# Altium schematic sheet ltk-hall-main.SchDoc
size A3; Organization: Altium Limited; Address1: L3, 12a Rodborough Rd; Address2: Frenchs Forest; Address3: NSW; Address4: Australia 2086
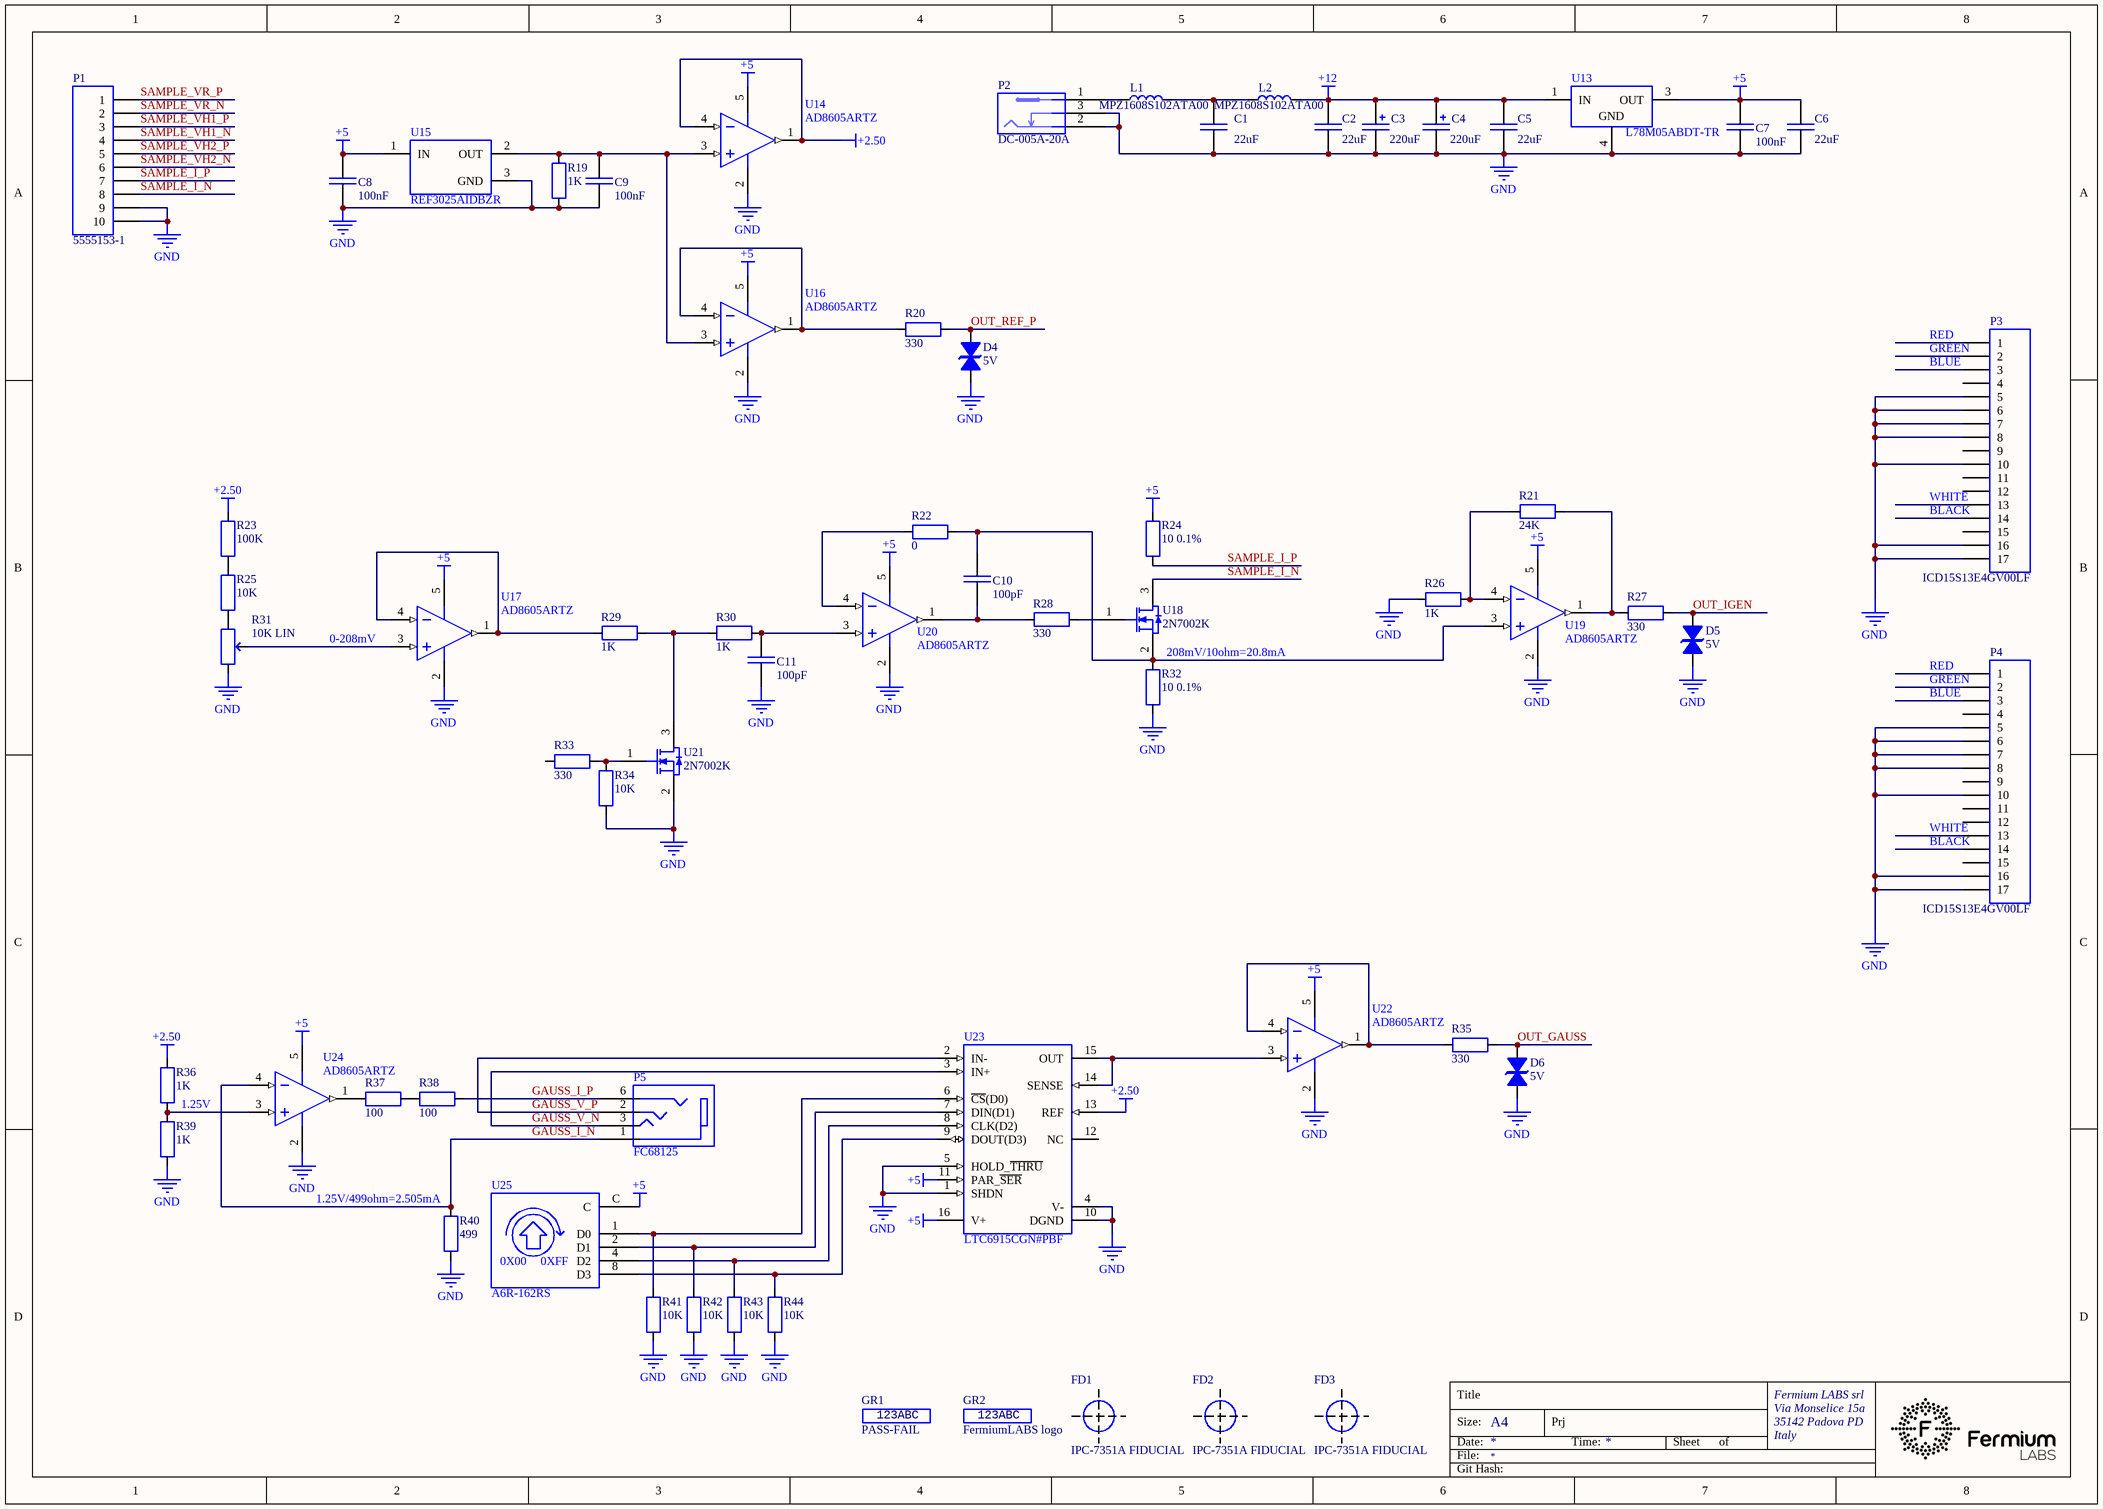
[diagram p0: ltk-hall-main.SchDoc]

## Parts
C1  22uF  [CAP 0805_2012]
C2  22uF  [CAP 0805_2012]
C3  220uF  [3924B366-8672-45E9-B0BE-62DACC24E783]
C4  220uF  [3924B366-8672-45E9-B0BE-62DACC24E783]
C5  22uF  [CAP 0805_2012]
C6  22uF  [CAP 0805_2012]
C7  100nF  [CAP 0603_1608]
C8  100nF  [CAP 0603_1608]
C9  100nF  [CAP 0603_1608]
C10  100pF  [CAP 0603_1608]
C11  100pF  [CAP 0603_1608]
D4  5V  [SOD523F]
D5  5V  [SOD523F]
D6  5V  [SOD523F]
FD1  IPC-7351A FIDUCIAL  [FIDUCIAL-IPC-7351A]  (no BOM)
FD2  IPC-7351A FIDUCIAL  [FIDUCIAL-IPC-7351A]  (no BOM)
FD3  IPC-7351A FIDUCIAL  [FIDUCIAL-IPC-7351A]  (no BOM)
GR1  PASS-FAIL  [0B1556B7-A534-4801-B57D-01EFA34B1205]  (no BOM)
GR2  FermiumLABS logo  [5394DE47-A0E8-4329-8464-7791B7C19310]  (no BOM)
L1  MPZ1608S102ATA00  [FER 0603_1608]
L2  MPZ1608S102ATA00  [FER 0603_1608]
P1  5555153-1  [03FA2727-72E9-446E-856D-3DD573B1EBDD]
P2  DC-005A-20A  [F0972D8A-C5C0-4A84-836D-A9666EE65C2D]
P3  ICD15S13E4GV00LF  [66D8AC91-DC10-42D3-BF25-693004815827]
P4  ICD15S13E4GV00LF  [66D8AC91-DC10-42D3-BF25-693004815827]
P5  FC68125  [977BFFC7-4CFC-4119-A8B4-AB88E5A1DB2B]
R19  1K  [RES 0603_1608]
R20  330
R21  24K
R22  0  [RES 0603_1608]
R23  100K
R24  10 0.1%  [RES 0603_1608]
R25  10K  [RES 0603_1608]
R26  1K  [RES 0603_1608]
R27  330
R28  330
R29  1K  [RES 0603_1608]
R30  1K  [RES 0603_1608]
R31  10K LIN  [2EF88547-EDEF-4A49-A522-C215618D4BC7]
R32  10 0.1%  [RES 0603_1608]
R33  330
R34  10K  [RES 0603_1608]
R35  330
R36  1K  [RES 0603_1608]
R37  100
R38  100
R39  1K  [RES 0603_1608]
R40  499
R41  10K  [RES 0603_1608]
R42  10K  [RES 0603_1608]
R43  10K  [RES 0603_1608]
R44  10K  [RES 0603_1608]
U13  L78M05ABDT-TR  [4BDA507D-BB70-4009-B963-85AD90086B51]
U14  AD8605ARTZ  [A3DDA0BC-073E-4B18-9613-F713A7EC1E27]
U15  REF3025AIDBZR  [TI SOT-23-3 DBZ]
U16  AD8605ARTZ  [A3DDA0BC-073E-4B18-9613-F713A7EC1E27]
U17  AD8605ARTZ  [A3DDA0BC-073E-4B18-9613-F713A7EC1E27]
U18  2N7002K  [ON SEMI SOT-23-3]
U19  AD8605ARTZ  [A3DDA0BC-073E-4B18-9613-F713A7EC1E27]
U20  AD8605ARTZ  [A3DDA0BC-073E-4B18-9613-F713A7EC1E27]
U21  2N7002K  [ON SEMI SOT-23-3]
U22  AD8605ARTZ  [A3DDA0BC-073E-4B18-9613-F713A7EC1E27]
U23  LTC6915CGN#PBF  [517EE8A2-9FD8-4174-996D-BDBF76CA3EEB]
U24  AD8605ARTZ  [A3DDA0BC-073E-4B18-9613-F713A7EC1E27]
U25  A6R-162RS  [2599C238-5645-4A8C-8BF9-C7515FACCFA0]

## Nets
+2.50: R23.2 R36.2 U14.1(OUT) U14.4(-IN) U23.13(REF)
+5: C6.1 C7.1 C8.1 R24.2 U13.3(OUT) U14.5(+V) U15.1(IN) U16.5(+V) U17.5(+V) U19.5(+V) U20.5(+V) U22.5(+V) U23.11(PAR_~{SER}) U23.16(V+) U24.5(+V) U25.C
+12: C2.1 C3.1 C4.1 C5.1 L2.2 U13.1(IN)
GND: C1.2 C2.2 C3.2 C4.2 C5.2 C6.2 C7.2 C8.2 C9.2 C11.2 D4.2 D5.2 D6.2 P1.9 P1.10 P2.2 P2.3 P3.5 P3.6 P3.7 P3.8 P3.10 P3.16 P3.17 P4.5 P4.6 P4.7 P4.8 P4.10 P4.16 P4.17 R19.1 R26.1 R31.3 R32.1 R34.1 R39.1 R40.1 R41.1 R42.1 R43.1 R44.1 U13.4(GND) U14.2(-V) U15.3(GND) U16.2(-V) U17.2(-V) U19.2(-V) U20.2(-V) U21.2(S) U22.2(-V) U23.1(SHDN) U23.4(V-) U23.5(HOLD_~{THRU}) U23.10(DGND) U24.2(-V)
GAUSS_I_N: P5.1 R40.2 U24.4(-IN)
GAUSS_I_P: P5.6 R38.2
GAUSS_V_N: P5.3 U23.3(IN+)
GAUSS_V_P: P5.2 U23.2(IN-)
OUT_GAUSS: D6.1 R35.2
OUT_IGEN: D5.1 R27.2
OUT_REF_P: D4.1 R20.2
SAMPLE_I_N: P1.8 U18.3(D)
SAMPLE_I_P: P1.7 R24.1
SAMPLE_VH1_N: P1.4
SAMPLE_VH1_P: P1.3
SAMPLE_VH2_N: P1.6
SAMPLE_VH2_P: P1.5
SAMPLE_VR_N: P1.2
SAMPLE_VR_P: P1.1
NetC1_1: C1.1 L1.2 L2.1
NetC9_1: C9.1 R19.2 U14.3(+IN) U15.2(OUT) U16.3(+IN)
NetC10_1: C10.1 R22.2 R32.2 U18.2(S) U19.3(+IN)
NetC10_2: C10.2 R28.1 U20.1(OUT)
NetC11_1: C11.1 R30.2 U20.3(+IN)
NetL1_1: L1.1 P2.1
NetR20_1: R20.1 U16.1(OUT) U16.4(-IN)
NetR21_1: R21.1 R26.2 U19.4(-IN)
NetR21_2: R21.2 R27.1 U19.1(OUT)
NetR22_1: R22.1 U20.4(-IN)
NetR23_1: R23.1 R25.2
NetR25_1: R25.1 R31.1
NetR28_2: R28.2 U18.1(G)
NetR29_1: R29.1 U17.1(OUT) U17.4(-IN)
NetR29_2: R29.2 R30.1 U21.3(D)
NetR31_2: R31.2 U17.3(+IN)
NetR33_2: R33.2 R34.2 U21.1(G)
NetR35_1: R35.1 U22.1(OUT) U22.4(-IN)
NetR36_1: R36.1 R39.2 U24.3(+IN)
NetR37_1: R37.1 U24.1(OUT)
NetR37_2: R37.2 R38.1
NetR41_2: R41.2 U23.6(~{CS}(D0)) U25.1(D0)
NetR42_2: R42.2 U23.7(DIN(D1)) U25.2(D1)
NetR43_2: R43.2 U23.8(CLK(D2)) U25.4(D2)
NetR44_2: R44.2 U23.9(DOUT(D3)) U25.8(D3)
NetU22_3: U22.3(+IN) U23.14(SENSE) U23.15(OUT)

Not connected (* = marked no-connect by the designer): P3 1 2 3 4 9 11 12 13 14 15; P4 1 2 3 4 9 11 12 13 14 15; R33 1; U23 12(NC)

## Notes on the sheet
- (near P3) GREEN
- (near P3) BLUE
- (near P3) RED
- (near P3) WHITE
- (near P3) BLACK
- (near U17) 0-208mV
- 208mV/10ohm=20.8mA
- (near P4) GREEN
- (near P4) BLUE
- (near P4) RED
- (near P4) WHITE
- (near P4) BLACK
- 1.25V
- (near R40) 1.25V/499ohm=2.505mA
- Title
- Fermium LABS srl
- Size:
- Date:
- File:
- A4
- Prj
- Time:
- Sheet
- of
- Via Monselice 15a
- 35142 Padova PD
- Italy
- Git Hash:
- (in symbol 50f8ea88-0034-49fe-a263-d8e97bc35e2f) 123ABC
- (in symbol bbf157ad-cd7a-4e82-97e3-d6a037590888) 0X00; 0XFF
- (in symbol d1abe19f-3fed-4f20-b2ed-afc0ffbc6628) 123ABC

## Library data of the parts
C1 C2 C5 C6 = 4e18e584-a077-4dfe-b9da-5e528e787323: CAP SMD MLCC 22uF 25V 0805 X5R; Manufacturer 1: Samsung Electro-Mechanics; Manufacturer Part Number 1: CL21A106KAYNNNE; id: 14817; Part Number: 4e18e584-a077-4dfe-b9da-5e528e787323; Manufacturer 2: Murata; Manufacturer Part Number 2: GRM21BR61E106KA73L; Value: 22uF
C3 C4 = 1a28df19-6d3e-4a71-836c-f22920f8e8ab: CAP  THT ELEC 220uF 25V 20%; Manufacturer 1: Rubycon; Manufacturer Part Number 1: 25PK220MEFC-6.3*11; id: 14782; Part Number: 1a28df19-6d3e-4a71-836c-f22920f8e8ab; ComponentLink1Description: Datasheet; ComponentLink1URL: http://localhost:8080/static/files/Rubycon-220uF-25V_C109337_12019-03-10_214953.757848.pdf?Rubycon-220uF-25V_C109337 (1).pdf; Value: 220uF
C7-C9 = 02841f84-ac15-41b5-9e17-915f8f067828: CAP SMD MLCC 100nF 25V 0603 X7R; Manufacturer 1: Samsung Electro-Mechanics; Manufacturer Part Number 1: CL10B104KA8NNNC; id: 14784; Part Number: 02841f84-ac15-41b5-9e17-915f8f067828; ComponentLink1Description: Datasheet; ComponentLink1URL: http://localhost:8080/static/files/Samsung-Electro-Mechanics-CL10B104KA8NNNC_C15902019-03-10_215548.826887.pdf?Samsung-Electro-Mechanics-CL10B104KA8NNNC_C1590.pdf; Value: 100nF
C10 C11 = ccf679fd-1b09-4431-be81-04c3ce295510: CAP SMD MLCC 100pF 100V 0603 C0G/NP0; Manufacturer 1: Yageo; Manufacturer Part Number 1: CC0603JRNPO0BN101; id: 14804; Part Number: ccf679fd-1b09-4431-be81-04c3ce295510; Value: 100pF
D4-D6 = daa58212-38e2-4326-a156-8e48058c46f1: DIODE SMD TVS 5V BIDIRECTIONAL SOD-523; Manufacturer 1: Born Semiconductor; Manufacturer Part Number 1: PESD5V0S1BBN; id: 14837; Part Number: daa58212-38e2-4326-a156-8e48058c46f1; ComponentLink1Description: Datasheet; ComponentLink1URL: http://localhost:8080/static/files/Nexperia-PESD5V0S1BB-115_C976402019-08-16_201905.624024.pdf?Nexperia-PESD5V0S1BB-115_C97640.pdf; ComponentLink2Description: Datasheet; ComponentLink2URL: http://localhost:8080/static/files/1901051701_Bourne-Semicon-Shenzhen-PESD5V0S1BBN_C3142642019-08-16_201911.992552.pdf?1901051701_Bourne-Semicon-Shenzhen-PESD5V0S1BBN_C314264.pdf; Manufacturer 2: Nexperia; Manufacturer Part Number 2: PESD5V0S1BB,115; Value: 5V
FD1-FD3 = 19da4612-eb95-43bb-9984-553a52b2a224: GRAPHICS FIDUCIAL IPC-7351A; id: 14800; Part Number: 19da4612-eb95-43bb-9984-553a52b2a224
GR1 = d1abe19f-3fed-4f20-b2ed-afc0ffbc6628: GRAPHICS PASS-FAIL MARK; id: 14801; Part Number: d1abe19f-3fed-4f20-b2ed-afc0ffbc6628
GR2 = 50f8ea88-0034-49fe-a263-d8e97bc35e2f: GRAPHICS LOGO FERMIUM LABS SRL; id: 14799; Part Number: 50f8ea88-0034-49fe-a263-d8e97bc35e2f
L1 L2 = a4b2e015-bf25-47b8-954c-a5b040744a3a: FER SMD CHIP 0603 800mA 1K@100MHz 300mOhm; Manufacturer 1: TDK; id: 14850; Part Number: a4b2e015-bf25-47b8-954c-a5b040744a3a; ComponentLink1Description: Datasheet; ComponentLink1URL: http://localhost:8080/static/files/TDK-MPZ1608S102ATA00_C768142019-08-18_021255.210641.pdf?TDK-MPZ1608S102ATA00_C76814.pdf; Manufacturer Part Number 1: MPZ1608S102ATA00
P1 = f401b84a-9695-45b1-951e-00bef0039069: CONN RJ45 SHIELDED; Manufacturer 1: TE Connectivity; id: 14843; Part Number: f401b84a-9695-45b1-951e-00bef0039069; ComponentLink1Description: Product Page; ComponentLink1URL: https://www.te.com/usa-en/product-5555153-1.html?te_campaign=oct_glo_manufacturer&elqCampaignId=26136&te_bu=Cor&te_type=other; ComponentLink2Description: Datasheet; ComponentLink2URL: http://localhost:8080/static/files/TE-Connectivity-5555153-1_C1250722019-08-17_152708.984028.pdf?TE-Connectivity-5555153-1_C125072.pdf; ComponentLink3Description: 3D Model; ComponentLink3URL: http://localhost:8080/static/files/ENG_CVM_CVM_5555153-1_C.3d_stp2019-08-17_152716.824354.zip?ENG_CVM_CVM_5555153-1_C.3d_stp.zip; Manufacturer Part Number 1: 5555153-1
P2 = b53db51a-1725-412b-9039-fa7a45c7c438: CONN THT DC JACK 0.5A 30VDC 5Kcycles; Manufacturer 1: HRO Electronics; id: 14780; Part Number: b53db51a-1725-412b-9039-fa7a45c7c438; ComponentLink1Description: Datasheet; ComponentLink1URL: http://localhost:8080/static/files/Korean-Hroparts-Elec-DC-005A-20A_C191049_22019-03-10_214231.486078.pdf?Korean-Hroparts-Elec-DC-005A-20A_C191049 (2).pdf; Manufacturer Part Number 1: DC-005A-20A
P3 P4 = af155709-b835-40ac-b9b5-4a44b0fd2777: CONN D-SUB HD 15POLES BLACK THT; Manufacturer 1: FCI; id: 14838; Part Number: af155709-b835-40ac-b9b5-4a44b0fd2777; ComponentLink1Description: Mechanical Drawing; ComponentLink1URL: http://localhost:8080/static/files/c-cd-00112019-08-16_203054.958624.pdf?c-cd-0011.pdf; ComponentLink2Description: Datasheet; ComponentLink2URL: http://localhost:8080/static/files/io_dsub_highdensity2019-08-16_203112.582695.pdf?io_dsub_highdensity.pdf; Manufacturer Part Number 1: ICD15S13E4GV00LF
P5 = 3e3c57e9-f1b8-4c12-8bb1-97da9eb9c220: CONN JACK 3.5MM 4POLE THT; Manufacturer 1: Cliff; id: 14844; Part Number: 3e3c57e9-f1b8-4c12-8bb1-97da9eb9c220; ComponentLink1Description: Datasheet; ComponentLink1URL: http://localhost:8080/static/files/Cliff-FC68125-datasheet2019-08-17_161810.238588.pdf?Cliff-FC68125-datasheet.pdf; Manufacturer Part Number 1: FC68125
R19 R26 R29 R30 R36 R39 = a678220f-9e9d-4863-a833-9993504f723c: RES SMD 1K OHM 1% 1/10W 0603; Manufacturer 1: Yageo; Manufacturer Part Number 1: RC0603FR-071KL; id: 14794; Part Number: a678220f-9e9d-4863-a833-9993504f723c; Value: 1K
R20 R27 R28 R33 R35 = e8555d7b-eeda-4727-b2e1-550cdc03d819: RES SMD 330 OHM 1% 1/10W 0603; Manufacturer 1: Yageo; Manufacturer Part Number 1: RC0603FR-07330RL; id: 12350; Part Number: e8555d7b-eeda-4727-b2e1-550cdc03d819; Value: 330
R21 = 89bb9559-07ab-4a9e-ba67-95cb66f30425: RES SMD 24K OHM 1% 1/10W 0603; Manufacturer 1: Yageo; Manufacturer Part Number 1: RC0603FR-0724KL; id: 12540; Part Number: 89bb9559-07ab-4a9e-ba67-95cb66f30425; Value: 24K
R22 = 6ae227f9-847f-4766-8522-e11a83531204: RES SMD 0 OHM 5% 1/10W 0603; Manufacturer 1: Yageo; Manufacturer Part Number 1: RC0603JR-070RL; id: 11973; Part Number: 6ae227f9-847f-4766-8522-e11a83531204; Value: 0
R23 = a6f23dcb-1502-42e9-827e-4bdfa60be22f: RES SMD 100K OHM 1% 1/16W 0402; Manufacturer 1: Yageo; Manufacturer Part Number 1: RC0402FR-07100KL; id: 11589; Part Number: a6f23dcb-1502-42e9-827e-4bdfa60be22f; Value: 100K
R24 R32 = f0166db1-b7e4-4c18-9511-2907615c1c51: RES SMD 10 OHM 0.1% 1/16W 25ppm  0603; Manufacturer 1: Uniroyal; Manufacturer Part Number 1: TC0325B100JT5E; id: 14842; Part Number: f0166db1-b7e4-4c18-9511-2907615c1c51; Manufacturer 2: Viking Tech; Manufacturer Part Number 2: AR03BTCX0100; Value: 10 0.1%
R25 R34 R41-R44 = 93242766-ba1d-462d-b58f-ce1dfc4129c8: RES SMD 10K OHM 1% 1/10W 0603; Manufacturer 1: Yageo; Manufacturer Part Number 1: RC0603FR-0710KL; id: 12101; Part Number: 93242766-ba1d-462d-b58f-ce1dfc4129c8; Value: 10K
R31 = 3df905ea-1e80-4add-859d-a36edd7f106c: POT 10K 20% SHAFT 6mmx7.4mm LIN; Manufacturer 1: ALPS; Manufacturer Part Number 1: RK09K1130A6S; id: 14828; Part Number: 3df905ea-1e80-4add-859d-a36edd7f106c; ComponentLink1Description: 3D Model; ComponentLink1URL: http://localhost:8080/static/files/RK09K1130A6S2019-08-17_031625.830758.zip?RK09K1130A6S.zip; ComponentLink2Description: Datasheet; ComponentLink2URL: http://localhost:8080/static/files/ALPS-Electric-RK09K1130A6S_C2097702019-08-17_031651.036431.pdf?ALPS-Electric-RK09K1130A6S_C209770.pdf; Value: 10K LIN
R37 R38 = 0a6c4b74-f837-4563-b154-6e196d753525: RES SMD 100 OHM 1% 1/10W 0603; Manufacturer 1: Yageo; Manufacturer Part Number 1: RC0603FR-07100RL; id: 12301; Part Number: 0a6c4b74-f837-4563-b154-6e196d753525; Value: 100
R40 = 3a10051a-dd65-4121-b0b9-1b40351a1843: RES SMD 499 OHM 1% 1/10W 0603; Manufacturer 1: Yageo; Manufacturer Part Number 1: RC0603FR-07499RL; id: 12368; Part Number: 3a10051a-dd65-4121-b0b9-1b40351a1843; Value: 499
U13 = 446536aa-1bdd-4764-8cae-49f4e0c126ff: IC SMD LINEAR VOLTAGE REGULATOR 5V 500mA DPAK/TO-252; Manufacturer 1: ST Microelectronics; id: 14848; Part Number: 446536aa-1bdd-4764-8cae-49f4e0c126ff; ComponentLink1Description: Datasheet; ComponentLink1URL: http://localhost:8080/static/files/STMicroelectronics-L78M05ABDT-TR_C580692019-08-17_184424.026041.pdf?STMicroelectronics-L78M05ABDT-TR_C58069.pdf; Manufacturer Part Number 1: L78M05ABDT-TR
U14 U16 U17 U19 U20 U22 U24 = 5610e9ea-bca8-49b2-8e5f-11409231f6a4: IC OPAMP 65uV 1pA RRIO 5V 80mA SOT-23-5; Manufacturer 1: Analog Devices; id: 14830; Part Number: 5610e9ea-bca8-49b2-8e5f-11409231f6a4; ComponentLink1Description: Datasheet; ComponentLink1URL: http://localhost:8080/static/files/Analog_Devices-AD8605ARTZ-REEL7-datasheet2019-08-16_175825.352099.pdf?Analog_Devices-AD8605ARTZ-REEL7-datasheet.pdf; Manufacturer Part Number 1: AD8605ARTZ
U15 = 0de0df07-6dfd-42d8-9fe7-171c27772811: IC VOLTAGE REF SERIES 2.5V 75ppm 0.2% SOT-23; Manufacturer 1: Texas Instruments; id: 14831; Part Number: 0de0df07-6dfd-42d8-9fe7-171c27772811; ComponentLink1Description: Datasheet; ComponentLink1URL: http://localhost:8080/static/files/Texas-Instruments-TI-REF3025AIDBZR_C113342019-08-16_180357.548624.pdf?Texas-Instruments-TI-REF3025AIDBZR_C11334.pdf; Manufacturer Part Number 1: REF3025AIDBZR
U18 U21 = 3a318f0a-3b94-47d9-91d5-8fc0a2f410e8: MOSFET N-CHANNEL LOGIC LEVEL 300mA 3ohm 60V ESD-PROT 2N7002K SOT-23; Manufacturer 1: ON Semiconductor; Manufacturer Part Number 1: 2N7002KT1G; id: 14846; Part Number: 3a318f0a-3b94-47d9-91d5-8fc0a2f410e8; ComponentLink1Description: Datasheet; ComponentLink1URL: http://localhost:8080/static/files/ON-Semicon-ON-2N7002KT1G_C1165842019-08-17_164859.682835.pdf?ON-Semicon-ON-2N7002KT1G_C116584.pdf; ComponentLink2Description: Datasheet; ComponentLink2URL: http://localhost:8080/static/files/Vishay-Intertech-2N7002K-T1-GE3_C814452019-08-17_164907.199439.pdf?Vishay-Intertech-2N7002K-T1-GE3_C81445.pdf; ComponentLink3Description: Datasheet; ComponentLink3URL: http://localhost:8080/static/files/DATA; Manufacturer 2: Vishay; Manufacturer 3: Diodes Inc.; Manufacturer Part Number 2: 2N7002K-T1-GE3; Manufacturer Part Number 3: 2N7002K-7
U23 = 59fe82cd-fd18-4813-9f52-e2e78a460aff: IC PGA G0-4094 SPI-PARALLEL 5V RRIO SSOP-16; Manufacturer 1: Analog Devices; id: 14835; Part Number: 59fe82cd-fd18-4813-9f52-e2e78a460aff; ComponentLink1Description: Datasheet; ComponentLink1URL: http://localhost:8080/static/files/Linear_Technology-LTC6915CDEPBF-datasheet2019-08-16_194420.284095.pdf?Linear_Technology-LTC6915CDE#PBF-datasheet.pdf; Manufacturer Part Number 1: LTC6915CGN#PBF
U25 = bbf157ad-cd7a-4e82-97e3-d6a037590888: SWITCH ROTARY HEX/BCD 16 POSITIONS; Manufacturer 1: Omron; id: 14834; Part Number: bbf157ad-cd7a-4e82-97e3-d6a037590888; ComponentLink1Description: Datasheet; ComponentLink1URL: http://localhost:8080/static/files/A6R-A6RV2019-08-16_190638.241287.PDF?A6R-A6RV.PDF; ComponentLink2Description: 3D Model; ComponentLink2URL: http://localhost:8080/static/files/2599C238-5645-4A8C-8BF9-C7515FACCFA02019-08-16_192704.487115.step?2599C238-5645-4A8C-8BF9-C7515FACCFA0.step; Manufacturer Part Number 1: A6R-162RS